# EAGLE design Open-Onoff (EAGLE 6.6.0)
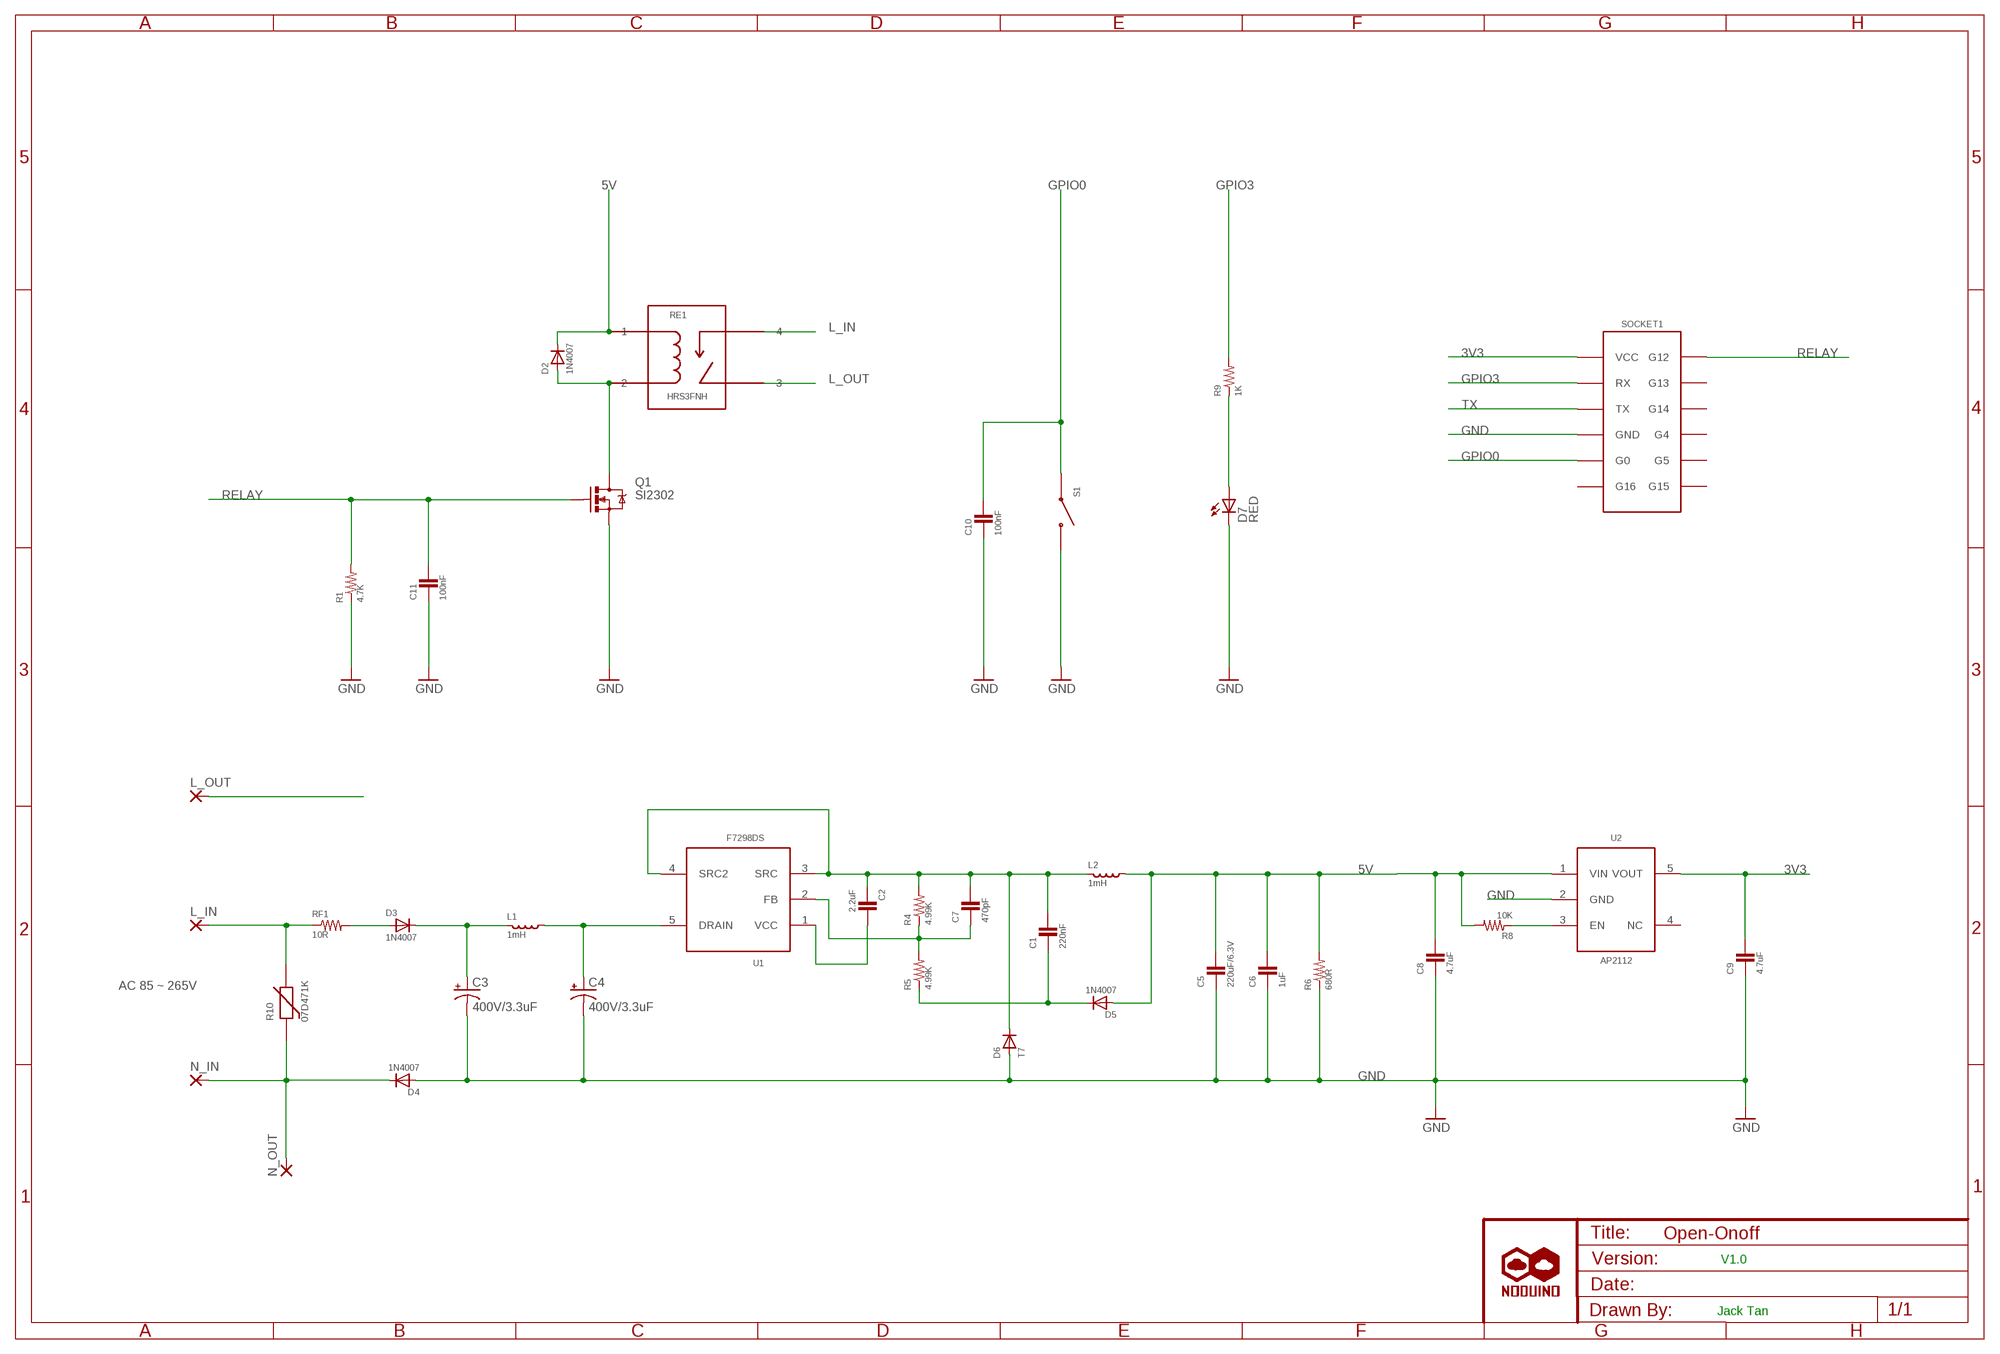
[diagram p0: schematic, sheet 1]

## Parts
C1  220nF  0402-CAP  [0402-CAP]
C2  2.2uF  0603-CAP  [0603-CAP]
C3  400V/3.3uF  CAP_POL  [CPOL-RADIOA-3.3UF-400V]
C4  400V/3.3uF  CAP_POL  [CPOL-RADIOA-3.3UF-400V]
C5  220uF/6.3V  B3528-CAP  [B3528-CAP]
C6  1uF  0402-CAP  [0402-CAP]
C7  470pF  0402-CAP  [0402-CAP]
C8  4.7uF  0603-CAP  [0603-CAP]
C9  4.7uF  0603-CAP  [0603-CAP]
C10  100nF  0402-CAP  [0402-CAP]
C11  100nF  0402-CAP  [0402-CAP]
D2  1N4007  DIODESOD  [SOD-323]
D3  1N4007  DIODE2.54-0.5  [2.54-0.5]
D4  1N4007  DIODE2.54-0.5  [2.54-0.5]
D5  1N4007  DIODE2.54-0.5  [2.54-0.5]
D6  T7  SUGC10JH  [SOD-123]
D7  RED  LED3MM  [LED3MM]
L1  1mH  INDUCTOR2.54-0.5  [2.54-0.5]
L2  1mH  INDUCTOR  [INDUCTOR-5-0.5]
L_IN  2,15/1,0  [2,15/1,0]
L_OUT  2,15/1,0  [2,15/1,0]
N_IN  2,15/1,0  [2,15/1,0]
N_OUT  2,15/1,0  [2,15/1,0]
Q1  SI2302  MOSFET-N-SMD  [SOT23-3]
R1  4.7K  0402-RESISTOR  [0402-RES]
R4  4.99K  0402-RESISTOR  [0402-RES]
R5  4.99K  0402-RESISTOR  [0402-RES]
R6  680R  0402-RESISTOR  [0402-RES]
R8  10K  0603-RESISTOR  [0603-RES]
R9  1K  0402-RESISTOR  [0402-RES]
R10  07D471K  [07D471K]
RE1  HRS3FNH  HKE-HRS3FNH  [HKE-HRS3FN]
RF1  10R  RESISTOR2.54-0.5  [2.54-0.5]
S1  SWITCH-4DIPTS-037  [SWITCH-TS-037]
SOCKET1  MOD-SOCKET-V2.0  [MOD-PLUG-SOCKET-V2.0]
U1  F7298  [SOT23-5]
U2  AP2112  [SOT23-5]
U$1  NODUINO-LOGO-ALL  [NODUINO-ALL-1]

## Nets
3V3: C9.2 SOCKET1.1(VCC) U2.5(VOUT)
5V: C5.2 C6.2 C8.2 D2.1(C) D5.P$1(A) L2.P$2(X2) R6.2 R8.2 RE1.1 U2.1(VIN)
GND: C3.P$2(-) C4.P$2(-) C5.1 C6.1 C8.1 C9.1 C10.1 C11.1 D4.P$1(A) D6.A D7.K(C) Q1.2(S) R1.1 R6.1 S1.P$1 SOCKET1.4(GND) U2.2(GND)
GPIO0: C10.2 S1.P$3 SOCKET1.5(G0)
GPIO3: R9.2 SOCKET1.2(RX)
L_IN: L_IN.1(P) R10.P$2 RE1.4 RF1.P$1
L_OUT: L_OUT.1(P) RE1.3
N: D4.P$2(C) N_IN.1(P) N_OUT.1(P) R10.P$1
N$2: D2.2(A) Q1.3(D) RE1.2
N$3: C3.P$1(+) D3.P$2(C) L1.P$1(X1)
N$5: C4.P$1(+) L1.P$2(X2) U1.5(DRAIN)
N$6: C1.2 C2.1 C7.2 D6.C L2.P$1(X1) R4.2 U1.3(SRC) U1.4(SRC2)
N$7: D3.P$1(A) RF1.P$2
N$10: C2.2 U1.1(VCC)
N$11: C7.1 R4.1 R5.2 U1.2(FB)
N$12: C1.1 D5.P$2(C) R5.1
N$13: R8.1 U2.3(EN)
N$14: D7.A R9.1
RELAY: C11.2 Q1.1(G) R1.2 SOCKET1.12(G12)
TX: SOCKET1.3(TX)
Unconnected: SOCKET1.6(G16) SOCKET1.7(G15) SOCKET1.8(G5) SOCKET1.9(G4) SOCKET1.10(G14) SOCKET1.11(G13) U2.4(NC)

## Notes on the sheet
- AC 85 ~ 265V
- V1.0
- Jack Tan

## Library data of the parts
C1 C6 C7 C10 C11 = ehl:0402-CAP
C2 C8 C9 = ehl:0603-CAP
C3 C4 = ehl:CAP_POL: Capacitor Polarized These are standard SMD and PTH capacitors. Normally 10uF, 47uF, and 100uF in electrolytic and tantalum varieties. Always verify the external diameter of the through hole cap, it varies with capacity, voltage, and manufacturer. The EIA devices should be standard.
C5 = ehl:B3528-CAP
D2-D5 = ehl:DIODE: Diode These are standard reverse protection diodes and small signal diodes. SMA package can handle up to about 1A. SOD-323 can handle about 200mA. What the SOD-323 package when ordering, there are some mfgs out there that are 5-pin packages.
D6 = ehl:SUGC10JH
D7 = adafruit:LED: LED OSRAM: - CHIPLED LG R971, LG N971, LY N971, LG Q971, LY Q971, LO R971, LY R971 LH N974, LH R974 LS Q976, LO Q976, LY Q976 LO Q996 - Hyper CHIPLED LW Q18S LB Q993, LB Q99A, LB R99A - SideLED LS A670, LO A670, LY A670, LG A670, LP A670 LB A673, LV A673, LT A673, LW A673 LH A674 LY A675 LS A676, LA A676, LO A676, LY A676, LW A676 LS A679, LY A679, LG A679 - Hyper Micro SIDELED® LS Y876, LA Y876, LO Y876, LY Y876 LT Y87S - SmartLED LW L88C, LW L88S LB L89C, LB L89S, LG L890 LS L89K, LO L89K, LY L89K LS L896, LA L896, LO L896, LY L896 - TOPLED LS T670, LO T670, LY T670, LG T670, LP T670 LSG T670, LSP T670, LSY T670, LOP T670, LYG T670 LG T671, LOG T671, LSG T671 LB T673, LV T673, LT T673, LW T673 LH T674 LS T676, LA T676, LO T676, LY T676, LB T676, LH T676, LSB T676, LW T676 LB T67C, LV T67C, LT T67C, LS T67K, LO T67K, LY T67K, LW E67C LS E67B, LA E67B, LO E67B, LY E67B, LB E67C, LV E67C, LT E67C LW T67C LS T679, LY T679, LG T679 LS T770, LO T770, LY T770, LG T770, LP T770 LB T773, LV T773, LT T773, LW T773 LH T774 LS E675, LA E675, LY E675, LS T675 LS T776, LA T776, LO T776, LY T776, LB T776 LHGB T686 LT T68C, LB T68C - Hyper Mini TOPLED® LB M676 - Mini TOPLED Santana® LG M470 LS M47K, LO M47K, LY M47K Source: http://www.osram.convergy.de/
L1 L2 = ehl:INDUCTOR
L_IN L_OUT N_IN N_OUT = ehl:2,15/1,0: THROUGH-HOLE PAD
Q1 = ehl:MOSFET-N
R1 R4-R6 R9 = ehl:0402-RESISTOR
R8 = ehl:0603-RESISTOR
R10 = ehl:07D471K
RE1 = ehl:HKE-HRS3FNH
RF1 = ehl:RESISTOR
S1 = ehl:SWITCH-4DIP
SOCKET1 = ehl:MOD-SOCKET-V2.0
U1 = ehl:F7298
U2 = ehl:AP2112
U$1 = ehl:NODUINO-LOGO-ALL

## Board
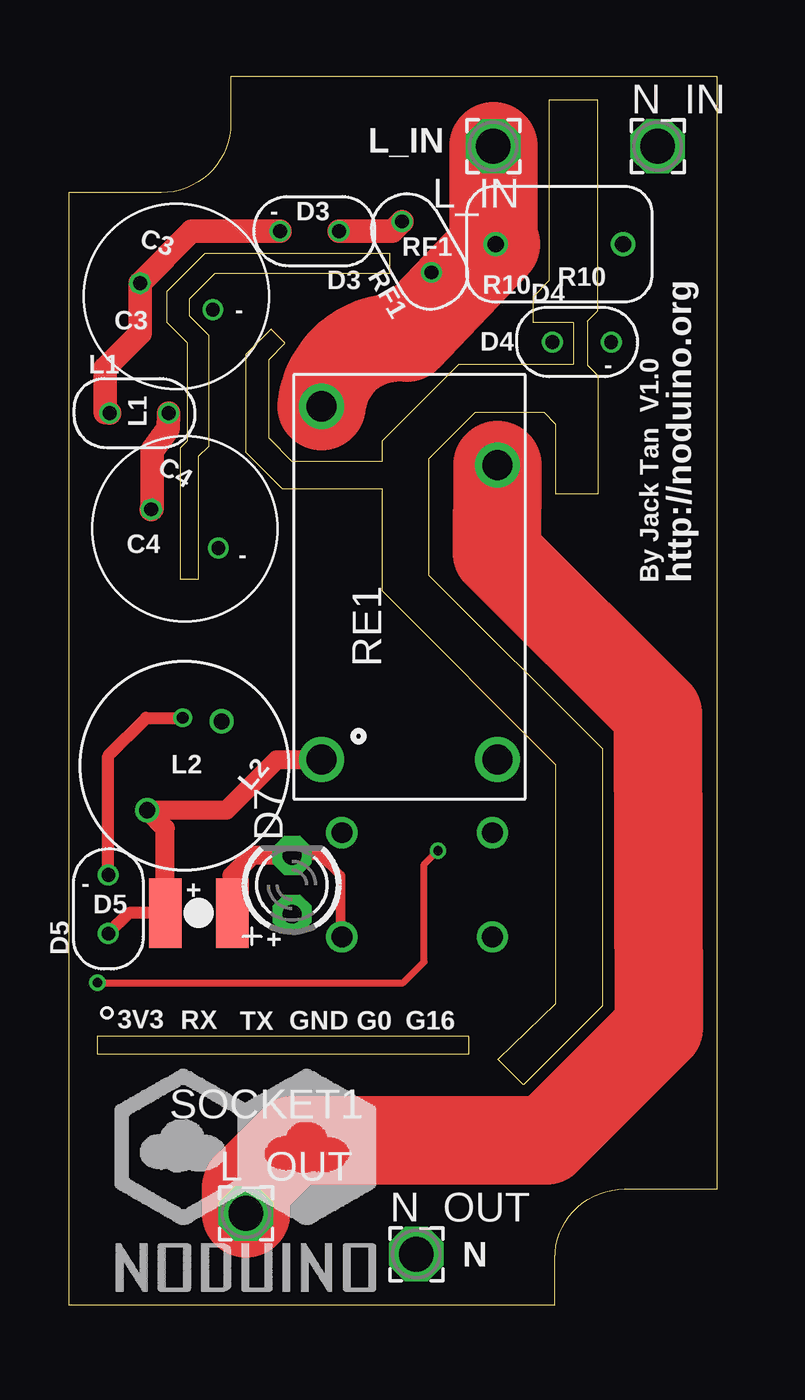
[diagram p1: board, top side]
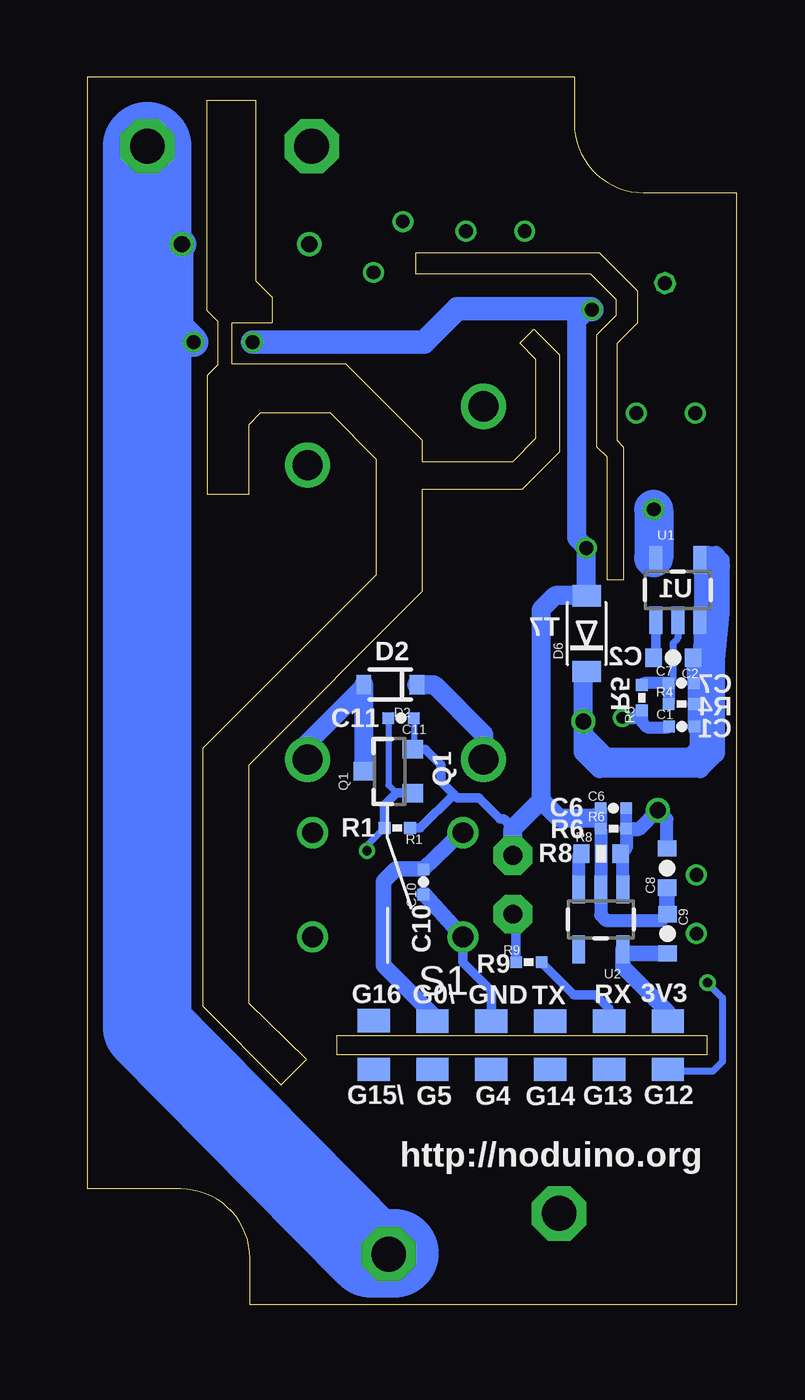
[diagram p2: board, bottom side, seen from below]

Size 28 x 53 mm. Coordinates in mm from the lower left corner, seen from the top.
Outline: 28,5 28,53 7,53 7,51 arc-90 4,48 0,48 0,0 21,0 21,2 arc-90 24,5 28,5
Copper layers (1*16): Top 0.035mm / dielectric 1.5mm / Bottom 0.035mm
Design rules "jackslab-micromod": minimum track width 6mil, minimum drill 0.3mm, track to track 6mil, track to pad 6mil, pad to pad 6mil, via to via 6mil, smd to smd 6mil, copper to edge 6mil, drill to drill 6mil, minimum pad ring 6mil, minimum via ring 6mil, stop-mask expansion 4mil, vias tented up to drill 20mil, thermal gap 6mil
Milling: 53 lines

### Footprints (pad centres in the part's own frame; a part is rotated, then mirrored left to right if it is on the bottom)
0402-CAP = smd 0.5 x 0.5: 1 -0.55,0; 2 0.55,0
0603-CAP = smd 0.7 x 0.8: 1 -0.85,0; 2 0.85,0
CPOL-RADIOA-3.3UF-400V = drill 0.6 octagon: P$1 -1.675,0 | drill 0.6: P$2 1.675,0
B3528-CAP = smd 1.4 x 3: 1 -1.45,0; 2 1.45,0
SOD-323 = smd 0.63 x 0.83: 1 -1.15,0; 2 1.15,0
2.54-0.5 = drill 0.6: P$1 -1.27,0; P$2 1.27,0
SOD-123 = smd 0.91 x 1.22: A 1.637,0; C -1.637,0
LED3MM = drill 0.813 pad 1.676 octagon: A -1.27,0; K 1.27,0
INDUCTOR-5-0.5 = drill 0.7: P$1 -2.5,0; P$2 2.5,0
2,15/1,0 = drill 1.5 pad 2.35 octagon: 1 0,0
SOT23-3 = smd 0.8 x 0.9: 1 -0.95,-1; 2 0.95,-1; 3 0,1.1
0402-RES = smd 0.5 x 0.5: 1 -0.55,0; 2 0.55,0
0603-RES = smd 0.7 x 0.8: 1 -0.85,0; 2 0.85,0
07D471K = drill 0.7: P$1 -2.75,0; P$2 2.75,0
HKE-HRS3FN = drill 1.3: 1 0,7.6; 2 0,0; 3 12.7,0; 4 15.24,7.6
SWITCH-TS-037 = drill 0.9: P$1 -3.25,2.25; P$2 3.25,2.25; P$3 -3.25,-2.25; P$4 3.25,-2.25
MOD-PLUG-SOCKET-V2.0 = smd 1.4 x 1 bottom: 1 14.2,-1.04; 2 11.66,-1.04; 3 9.12,-1.04; 4 6.58,-1.04; 5 4.04,-1.04; 6 1.5,-1.06; 7 1.5,1.04; 8 4.04,1.04; 9 6.58,1.04; 10 9.12,1.04; 11 11.66,1.04; 12 14.2,1.04
SOT23-5 = smd 0.55 x 1.2: 1 -0.95,-1.3; 2 0,-1.3; 3 0.95,-1.3; 4 0.95,1.3; 5 -0.95,1.3

### Placement (x,y rotation side)
C1  2.35,24.96 0 bottom
C2  2.73,27.93 180 bottom
C3  4.66,43.53 340 top
C4  5.02,33.5 330 top
C5  5.63,16.91 180 top
C6  5.31,21.43 0 bottom
C7  2.37,26.83 0 bottom
C8  2.99,18.85 90 bottom
C9  2.98,16.01 270 bottom
C10  13.51,18.26 90 bottom
C11  14.48,25.32 180 bottom
D2  14.94,26.77 180 bottom
D3  10.41,46.33 180 top
D4  22.16,41.56 0 top
D5  1.72,17.29 90 top
D6  6.47,28.96 90 bottom
D7  9.64,18.13 90 top
L1  3.05,38.48 0 top
L2  5,23.27 230 top
L_IN  18.34,50.01 180 top
L_OUT  7.66,3.94 0 top
N_IN  25.43,50.01 0 top
N_OUT  15.01,2.18 0 top
Q1  14.97,23.03 90 bottom
R1  14.64,20.58 180 bottom
R4  2.37,25.93 0 bottom
R5  4.08,26.2 90 bottom
R6  5.31,20.55 0 bottom
R8  5.85,19.47 0 bottom
R9  8.96,14.79 0 bottom
R10  21.19,45.78 180 top
RE1  18.52,23.54 90 top
RF1  15.04,45.66 120 top
S1  15.05,18.13 180 bottom
SOCKET1  17.16,11.2 180 top
U1  2.53,30.85 0 bottom
U2  5.86,16.63 180 bottom
U$1  1.64,-0.11 0 top

### Tracks (layer width: path | path; a pad name or v marks a point on that pad's centre or on a via)
3V3
  Bottom 0.66: C9.2 4.74,15.16 U2.5 4.91,14.58 2.96,12.63 SOCKET1.1
5V
  Top 0.508: C5.2 2.61,16.91 D5.P$1
  Top 0.813: C5.2 4.18,20.57 L2.P$2 6.82,21.35 9,23.53 RE1.1
  Bottom 0.508: R6.2 C6.2
  Bottom 0.559: R6.2 4.76,19.7 R8.2 4.91,19.38 U2.1 | 3.48,21.43 L2.P$2 3,20.95 C8.2
  Bottom 0.61: R6.2 4.2,20.55 L2.P$2
  Bottom 0.813: RE1.1 10.92,24.62 13.06,26.77 D2.1
GND
  Top 0.406: D7.K 10.87,19.4 11.73,18.53 11.73,15.95 S1.P$1
  Top 0.813: D7.K 7.93,19.4 7.06,18.53 7.06,16.92 C5.1
  Bottom 0.254: C11.1 13.93,24.02 Q1.2
  Bottom 0.305: 6.15,21.12 C6.1 6.15,21.14 6.15,21.02
  Bottom 0.406: Q1.2 13.42,23.98 12.75,23.3 12.75,22.59 12.19,22.04 | 12.19,22.04 12.04,21.88 11.12,21.88 10.21,20.97 10.05,20.97 9.64,20.56 | R1.1 13.65,20.58 12.19,22.04 | SOCKET1.4 10.58,13.55 11.8,14.77 S1.P$1
  Bottom 0.508: C6.1 R6.1
  Bottom 0.559: R6.1 U2.2 | U2.2 | U2.2 5.86,16.82 5.64,16.6 3.25,16.6 C9.1
  Bottom 0.66: C8.1 3,16.88 C9.1 | C10.1 13.46,17.71 S1.P$1
  Bottom 0.813: C3.P$2 6.41,42.95 6.91,42.45 6.91,33.1 C4.P$2 D6.A 7.83,30.6 8.43,30 8.43,21.78 | 8.43,21.78 7.67,21.02 6.15,21.02 | 8.43,21.78 9.64,20.56 D7.K
  Bottom 1.016: D4.P$1 13.49,41.56 12.05,43 6.28,43 C3.P$2
GPIO0
  Bottom 0.66: S1.P$3 11.91,20.34 C10.2 14.71,18.81 15.24,18.27 15.24,14.65 13.12,12.53 SOCKET1.5
GPIO3
  Bottom 0.406: R9.2 7.01,13.38 6.1,13.38 5.5,12.79 SOCKET1.2
L_IN
  Top 0.813: 14.86,42.13 arc-90 RF1.P$1
  Top 1.27: 14.61,41.73 14.86,42.13
  Top 2.54: 18.34,45.78 arc90 R10.P$2
  Top 3.81: L_IN.1 18.34,45.78 | R10.P$2 14.61,41.73 arc90 RE1.4
L_OUT
  Top 3.81: RE1.3 18.51,32.44 25.43,25.51 25.48,11.95 20.63,7.1 9.69,7.1 7.73,5.14 arc45 7.66,4.96 L_OUT.1
N
  Bottom 0.61: 25.45,49.99 25.45,47.29
  Bottom 0.813: 14.77,2.22 N_OUT.1
  Bottom 1.016: R10.P$1 23.94,42.07
  Bottom 1.27: 23.94,42.07 D4.P$2 | 25.45,47.29 R10.P$1
  Bottom 3.81: N_IN.1 25.45,49.99 25.45,11.97 15.8,2.22 14.77,2.22
N$2
  Bottom 0.813: RE1.2 18.54,23.56 18.54,24.22 16.09,26.67 D2.2 16.09,23.05 Q1.3
N$3
  Top 1.016: L1.P$1 1.57,38.51 1.57,40.42 3.08,41.93 C3.P$1 5.32,46.33 D3.P$2
N$5
  Top 1.016: L1.P$2 4.3,37.81 3.61,36.86 3.61,34.37 C4.P$1
  Bottom 1.422: 3.57,32.23 U1.5
  Bottom 1.676: C4.P$1 3.57,32.23
N$6
  Bottom 0.305: 1.07,30.06 arc90 U1.3
  Bottom 0.508: U1.4 1.58,32.23 1.31,32.5
  Bottom 0.559: 1.59,27.66 C2.1 | U1.4 1.23,32.47 0.88,32.47 0.58,32.17 0.57,31.75 1.07,31.63 | U1.3 0.9,29.54
  Bottom 0.61: C2.1 1.85,26.86 C7.2 R4.2 | R4.2 | R4.2 1.82,24.98 C1.2
  Bottom 0.66: 1.04,28.72 arc90 C2.1
  Bottom 0.813: L2.P$1 6.61,24.62 5.64,23.65 1.96,23.65 1.59,24.02 1.59,27.66 | L2.P$1 6.61,27.19 D6.C | L2.P$1 6.61,23.84 5.92,23.15 1.57,23.15 0.91,23.81 0.91,27.87 0.71,29.87 1.46,28.42 1.44,29.54 0.9,29.54
  Bottom 1.524: 1.07,31.63 1.07,30.06
N$7
  Top 1.016: D3.P$1 13.98,46.33 RF1.P$2
N$10
  Bottom 0.406: U1.1 3.48,27.98 C2.2
N$11
  Bottom 0.305: U1.2 2.53,28.76 2.74,28.55 2.74,27.01 C7.1
  Bottom 0.508: R4.1 C7.1 4,26.83 R5.2 | R4.1
N$12  (via drill 0.5)
  Top 0.508: D5.P$2 1.72,23.71 3.35,25.34 v4.93,25.34
  Bottom 0.508: C1.1 2.94,24.92 3.86,24.92 4.08,25.15 R5.1 4.4,25.34 v4.93,25.34
N$13
  Bottom 0.559: U2.3 6.81,19.35 R8.1
N$14
  Bottom 0.406: R9.1 9.52,16.73 D7.A
RELAY  (via drill 0.4)
  Top 0.305: v1.25,13.9 14.45,13.9 15.35,14.8 15.35,19 v15.95,19.6
  Bottom 0.254: C11.2 15.03,22.43 14.68,22.09
  Bottom 0.305: v1.25,13.9 0.6,13.25 0.6,10.5 1.02,10.08 2.88,10.08 SOCKET1.12 | v15.95,19.6 15.95,19.82 R1.2
  Bottom 0.406: R1.2 15.19,21.57 14.68,22.09 Q1.1

### Text on the board
tPlace: L_IN | D3 | - | RF1 | R10 | C3 | - | D4 | - | L1 | C4 | - | By Jack Tan V1.0 | http://noduino.org | L2 | - | + | D5 | + | 3V3 | RX | TX | GND | G0 | G16 | N
bPlace: U1 | T7 | C2 | D2 | C7 | R5 | R4 | C1 | C11 | Q1 | C6 | R6 | R8 | R1 | R9 | C10 | 3V3 | RX | TX | GND | G0\ | G16 | G12 | G13 | G14 | G4 | G5 | G15\ | http://noduino.org
tStop: OpenOnOff
bStop: By Jack Tan V1.0 | OpenOnOff